# Altium schematic sheet PAGE04_飞机端BMS.SchDoc
size A4
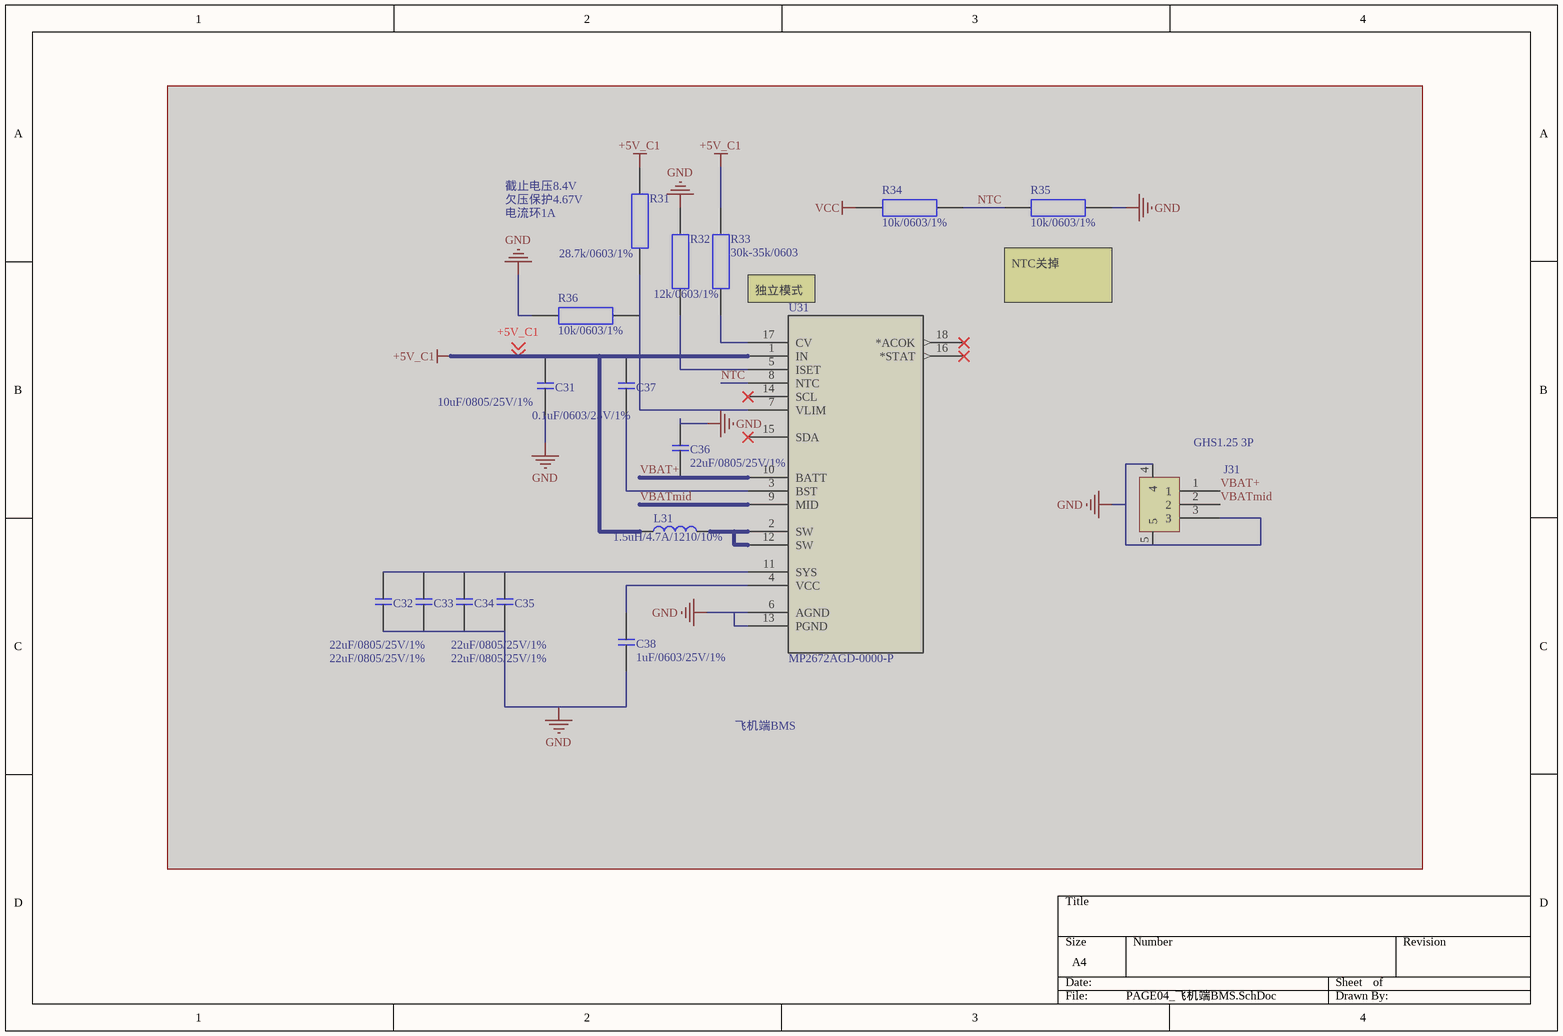
[diagram p0: PAGE04_飞机端BMS.SchDoc]

## Parts
C31  10uF/0805/25V/1%  [0603_ding_C]  (masked out: inside a compile mask, not in the netlist)
C32  22uF/0805/25V/1%  [0603_ding_C]  (masked out: inside a compile mask, not in the netlist)
C33  22uF/0805/25V/1%  [0603_ding_C]  (masked out: inside a compile mask, not in the netlist)
C34  22uF/0805/25V/1%  [0603_ding_C]  (masked out: inside a compile mask, not in the netlist)
C35  22uF/0805/25V/1%  [0603_ding_C]  (masked out: inside a compile mask, not in the netlist)
C36  22uF/0805/25V/1%  [0603_ding_C]  (masked out: inside a compile mask, not in the netlist)
C37  0.1uF/0603/25V/1%  [0603_ding_C]  (masked out: inside a compile mask, not in the netlist)
C38  1uF/0603/25V/1%  [0603_ding_C]  (masked out: inside a compile mask, not in the netlist)
J31  GHS1.25 3P  [SM03B_GHS立式]  (masked out: inside a compile mask, not in the netlist)
L31  1.5uH/4.7A/1210/10%  [1210_ding_C]  (masked out: inside a compile mask, not in the netlist)
R31  28.7k/0603/1%  [0603_ding_R]  (masked out: inside a compile mask, not in the netlist)
R32  12k/0603/1%  [0603_ding_R]  (masked out: inside a compile mask, not in the netlist)
R33  30k-35k/0603  [0603_ding_R]  (masked out: inside a compile mask, not in the netlist)
R34  10k/0603/1%  [0603_ding_R]  (masked out: inside a compile mask, not in the netlist)
R35  10k/0603/1%  [0603_ding_R]  (masked out: inside a compile mask, not in the netlist)
R36  10k/0603/1%  [0603_ding_R]  (masked out: inside a compile mask, not in the netlist)
U31  MP2672AGD-0000-P  [QFN-18_MP2672A_MNP]  (masked out: inside a compile mask, not in the netlist)

## Notes on the sheet
- 电流环1A
- 欠压保护4.67V
- 截止电压8.4V
- 独立模式
- (near R35) NTC关掉
- 飞机端BMS

## Library data of the parts
C31-C38 = C
J31 = GHS1.25 3P: 立式
L31 = L-ip6826
R31-R36 = RES
U31 = MP2672AGD-0000-P: 2A Boost Charger with NVDC Power Path Management and Integrated Cell Balancing for 2-Cell Li-Ion Batteries in Series; Manufacturer_Name: Monolithic Power Systems; Copyright: Copyright (C) 2026 Ultra Librarian. All rights reserved.; Manufacturer_Part_Number: MP2672AGD-0000-P; RefDes: RefDes; Type: Type